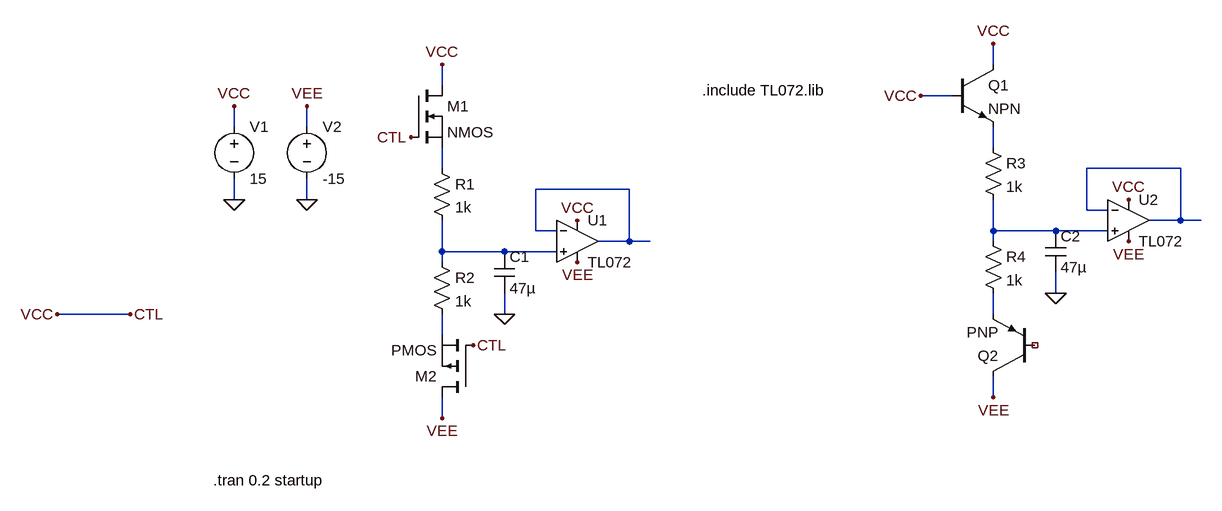
[diagram p0: schematic offset.asc]
offset.asc, the LTspice schematic file:
Version 4.1
SHEET 1 1828 680
WIRE 912 -144 912 -176
WIRE 64 -112 64 -144
WIRE 848 -96 800 -96
WIRE -256 -48 -256 -80
WIRE -144 -48 -144 -80
WIRE 912 -16 912 -48
WIRE 64 16 64 -16
WIRE 1200 16 1056 16
WIRE 352 48 208 48
WIRE -256 64 -256 32
WIRE -144 64 -144 32
WIRE 1056 80 1056 16
WIRE 1088 80 1056 80
WIRE 1200 96 1200 16
WIRE 1200 96 1152 96
WIRE 1232 96 1200 96
WIRE 208 112 208 48
WIRE 240 112 208 112
WIRE 912 112 912 64
WIRE 1008 112 912 112
WIRE 1088 112 1008 112
WIRE 352 128 352 48
WIRE 352 128 304 128
WIRE 384 128 352 128
WIRE 912 128 912 112
WIRE 64 144 64 96
WIRE 160 144 64 144
WIRE 240 144 160 144
WIRE 64 160 64 144
WIRE 1008 208 1008 176
WIRE -416 240 -528 240
WIRE 160 240 160 208
WIRE 912 240 912 208
WIRE 64 272 64 240
WIRE 912 368 912 336
WIRE 64 400 64 368
FLAG 160 240 0
FLAG -256 64 0
FLAG -144 64 0
FLAG -256 -80 VCC
FLAG -144 -80 VEE
FLAG 64 -144 VCC
FLAG 64 400 VEE
FLAG 272 96 VCC
FLAG 272 160 VEE
FLAG 16 -32 CTL
FLAG 112 288 CTL
FLAG -416 240 CTL
FLAG -528 240 VCC
FLAG 1008 208 0
FLAG 912 -176 VCC
FLAG 912 368 VEE
FLAG 1120 64 VCC
FLAG 1120 128 VEE
FLAG 800 -96 VCC
SYMBOL cap 144 144 R0
SYMATTR InstName C1
SYMATTR Value 47µ
SYMBOL res 48 0 R0
SYMATTR InstName R1
SYMATTR Value 1k
SYMBOL res 48 144 R0
SYMATTR InstName R2
SYMATTR Value 1k
SYMBOL OpAmps\\opamp2 272 64 R0
SYMATTR InstName U1
SYMATTR Value TL072
SYMBOL voltage -256 -64 R0
WINDOW 123 0 0 Left 0
WINDOW 39 0 0 Left 0
SYMATTR InstName V1
SYMATTR Value 15
SYMBOL voltage -144 -64 R0
WINDOW 123 0 0 Left 0
WINDOW 39 0 0 Left 0
SYMATTR InstName V2
SYMATTR Value -15
SYMBOL nmos 16 -112 R0
SYMATTR InstName M1
SYMBOL pmos 112 368 R180
SYMATTR InstName M2
SYMBOL cap 992 112 R0
SYMATTR InstName C2
SYMATTR Value 47µ
SYMBOL res 896 -32 R0
SYMATTR InstName R3
SYMATTR Value 1k
SYMBOL res 896 112 R0
SYMATTR InstName R4
SYMATTR Value 1k
SYMBOL OpAmps\\opamp2 1120 32 R0
SYMATTR InstName U2
SYMATTR Value TL072
SYMBOL npn 848 -144 R0
SYMATTR InstName Q1
SYMBOL pnp 976 336 R180
SYMATTR InstName Q2
TEXT 464 -104 Left 2 !.include TL072.lib
TEXT -288 496 Left 2 !.tran 0.2 startup

The netlist it stands for:
* offset.asc
C1 N006 0 47µ
R1 N002 N006 1k
R2 N006 N008 1k
X§U1 N006 N004 CTL VEE N004 TL072  ; pins In+ In- V+ V- OUT
V1 CTL 0 15
V2 VEE 0 -15
M1 CTL CTL N002 N002 NMOS
M2 VEE CTL N008 N008 PMOS
C2 N005 0 47µ
R3 N001 N005 1k
R4 N005 N007 1k
X§U2 N005 N003 CTL VEE N003 TL072  ; pins In+ In- V+ V- OUT
Q1 CTL CTL N001 0 NPN
Q2 VEE NC_01 N007 0 PNP
.model NPN NPN
.model PNP PNP
.lib standard.bjt
.model NMOS NMOS
.model PMOS PMOS
.lib standard.mos
.include TL072.lib
.tran 0.2 startup
.backanno
.end